# EAGLE design Power module 12V to 5V (EAGLE 8.2.2)
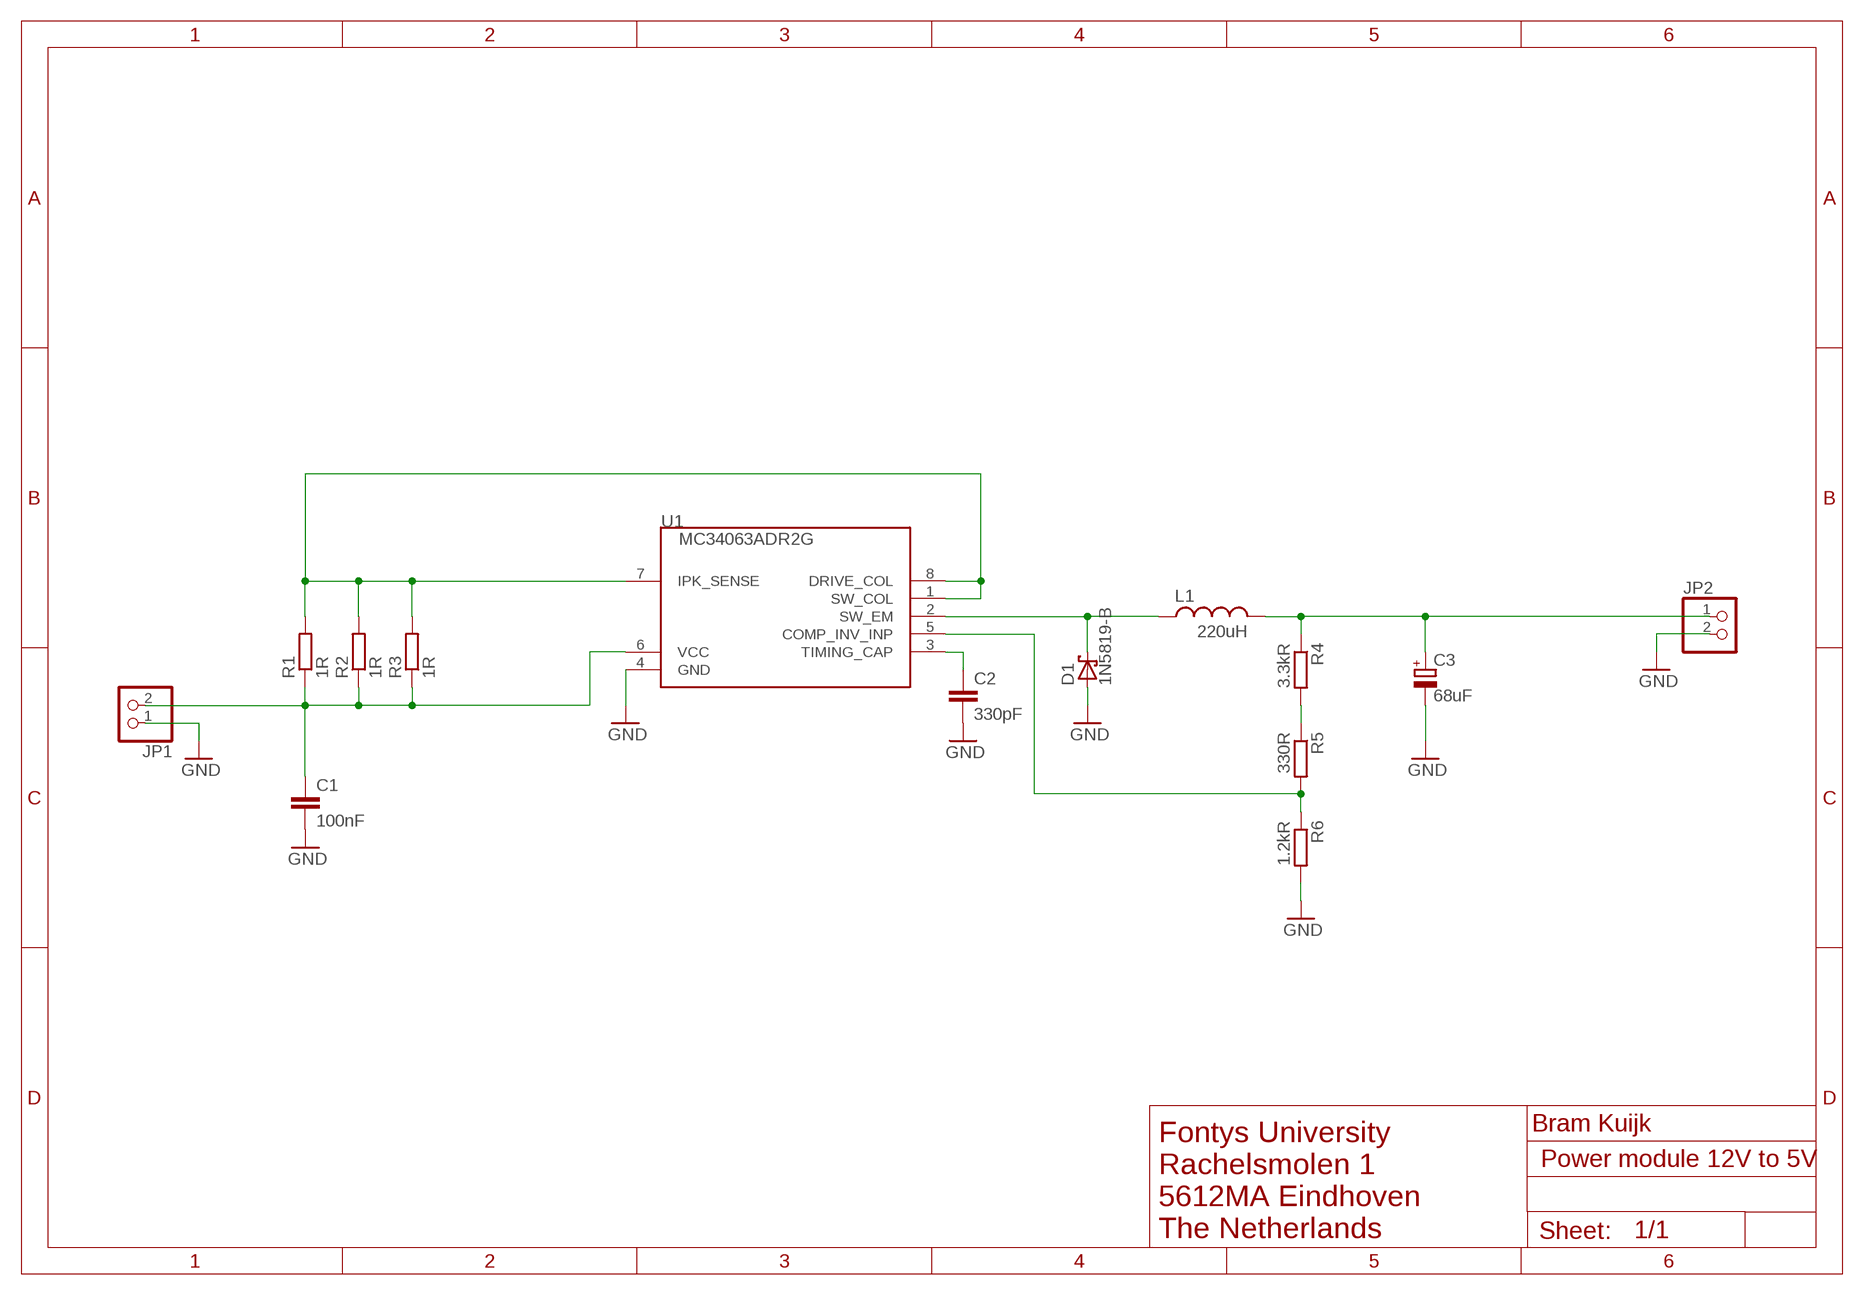
[diagram p0: schematic, sheet 1]

## Parts
C1  100nF  C-EU050-045X075  [C050-045X075]
C2  330pF  C-EU050-045X075  [C050-045X075]
C3  68uF  CPOL-EUE2.5-7  [E2,5-7]
D1  1N5819-B  [DO41-7.6]
JP1  PINHD-1X2  [1X02]
JP2  PINHD-1X2  [1X02]
L1  220uH  SRR1208  [SRR1208_L]
R1  1R  R-EU_0207/10  [0207/10]
R2  1R  R-EU_0207/10  [0207/10]
R3  1R  R-EU_0207/10  [0207/10]
R4  3.3kR  R-EU_0207/10  [0207/10]
R5  330R  R-EU_0207/10  [0207/10]
R6  1.2kR  R-EU_0207/10  [0207/10]
U1  MC34063ADR2G  [SOIC8]

## Nets
GND: C1.2 C2.2 C3.- D1.A JP1.1 JP2.2 R6.2 U1.4(GND)
N$1: C1.1 JP1.2 R1.1 R2.1 R3.1 U1.6(VCC)
N$2: R1.2 R2.2 R3.2 U1.1(SW_COL) U1.7(IPK_SENSE) U1.8(DRIVE_COL)
N$3: D1.C L1.P$1 U1.2(SW_EM)
N$4: C3.+ JP2.1 L1.P$2 R4.1
N$6: C2.1 U1.3(TIMING_CAP)
N$7: R5.2 R6.1 U1.5(COMP_INV_INP)
N$8: R4.2 R5.1

## Notes on the sheet
- Bram Kuijk
- Fontys University
  Rachelsmolen 1
  5612MA Eindhoven
  The Netherlands

## Library data of the parts
C1 C2 = rcl:C-EU: CAPACITOR, European symbol
C3 = resistor:CPOL-EU: POLARIZED CAPACITOR, European symbol
D1 = diode:1N581*: 1.0A SCHOTTKY BARRIER RECTIFIER Source: http://www.diodes.com/datasheets/ds23001.pdf
JP1 JP2 = pinhead:PINHD-1X2: PIN HEADER
L1 = BKlib:SRR1208
R1-R6 = rcl:R-EU_: RESISTOR, European symbol
U1 = BKlib:MC34063ADR2G

## Board
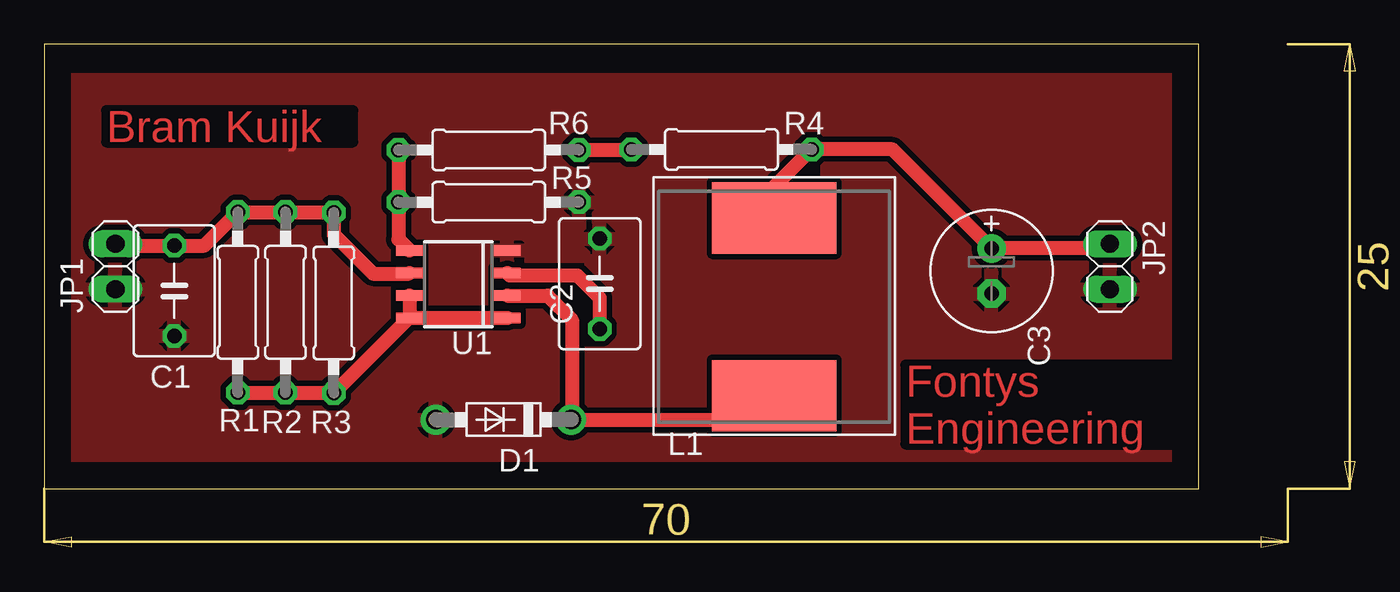
[diagram p1: board, top side]

Size 65 x 25 mm. Coordinates in mm from the lower left corner, seen from the top.
Outline: 0,0 65,0 65,25 0,25 0,0
Copper layers (1*16): Top 0.035mm / dielectric 1.5mm / Bottom 0.035mm
Design rules "default *": minimum track width 6mil, minimum drill 0.35mm, track to track 12mil, track to pad 12mil, pad to pad 12mil, via to via 12mil, smd to smd 12mil, copper to edge 1.5mm, drill to drill 6mil, minimum pad ring 10mil, minimum via ring 8mil, stop-mask expansion 4mil, vias tented up to drill 0mil, thermal gap 10mil

### Footprints (pad centres in the part's own frame; a part is rotated, then mirrored left to right if it is on the bottom)
C050-045X075 = drill 0.813 octagon: 1 -2.54,0; 2 2.54,0
E2,5-7 = drill 0.813 pad 1.6: + -1.27,0 | drill 0.813 pad 1.6 octagon: - 1.27,0
DO41-7.6 = drill 1.1 pad 1.7: A 3.81,0; C -3.81,0
1X02 = drill 1.016 long: 1 -1.27,0; 2 1.27,0
SRR1208_L = smd 4 x 7: P$1 -5,0; P$2 5,0
0207/10 = drill 0.813 octagon: 1 -5.08,0; 2 5.08,0
SOIC8 = smd 0.6 x 1.5: 1 -1.905,-2.75; 2 -0.635,-2.75; 3 0.635,-2.75; 4 1.905,-2.75; 5 1.905,2.75; 6 0.635,2.75; 7 -0.635,2.75; 8 -1.905,2.75

### Placement (x,y rotation side)
C1  7.31,11.13 270 top
C2  31.27,11.53 90 top
C3  53.33,12.25 270 top
D1  25.85,3.88 180 top
JP1  4,12.5 90 top
JP2  60,12.5 270 top
L1  41.09,10.23 90 top
R1  10.89,10.48 270 top
R2  13.58,10.48 270 top
R3  16.29,10.45 270 top
R4  38.12,19.09 180 top
R5  25.02,19.06 180 top
R6  25.02,16.12 0 top
U1  23.31,11.5 90 top

### Tracks (layer width: path | path; a pad name or v marks a point on that pad's centre or on a via)
GND
  pour Top: -1,23 71,23 71,-0.5 -1,-0.5
N$1
  Top 0.8: U1.6 20.52,12.1 18.5,12.1 16.29,14.31 R3.1 16.26,15.56 R2.1 R1.1 9,13.67 C1.1 4.1,13.67 JP1.2
N$2
  Top 0.8: U1.1 U1.8 | U1.7 U1.8 | U1.8 20.52,9.6 R3.2 16.26,5.4 R2.2 R1.2
N$3
  Top 0.8: U1.2 28.34,10.87 29.7,9.5 29.7,3.92 D1.C 39.74,3.88 L1.P$1
N$4
  Top 0.8: L1.P$2 41.09,16.98 R4.1 47.76,19.09 C3.+ 59.75,13.52 JP2.1
N$6
  Top 0.8: U1.3 26.2,12 30,12 31.27,10.73 C2.1
N$7
  Top 0.8: R5.2 R6.1 19.94,14.03 U1.5
N$8
  Top 0.8: R5.1 33.01,19.06 R4.2

### Text on the board
Top: Bram Kuijk | Fontys / Engineering